# Altium schematic sheet 0253_GPU POWER SEQUENCI.SchDoc
size 848 x 558 mm
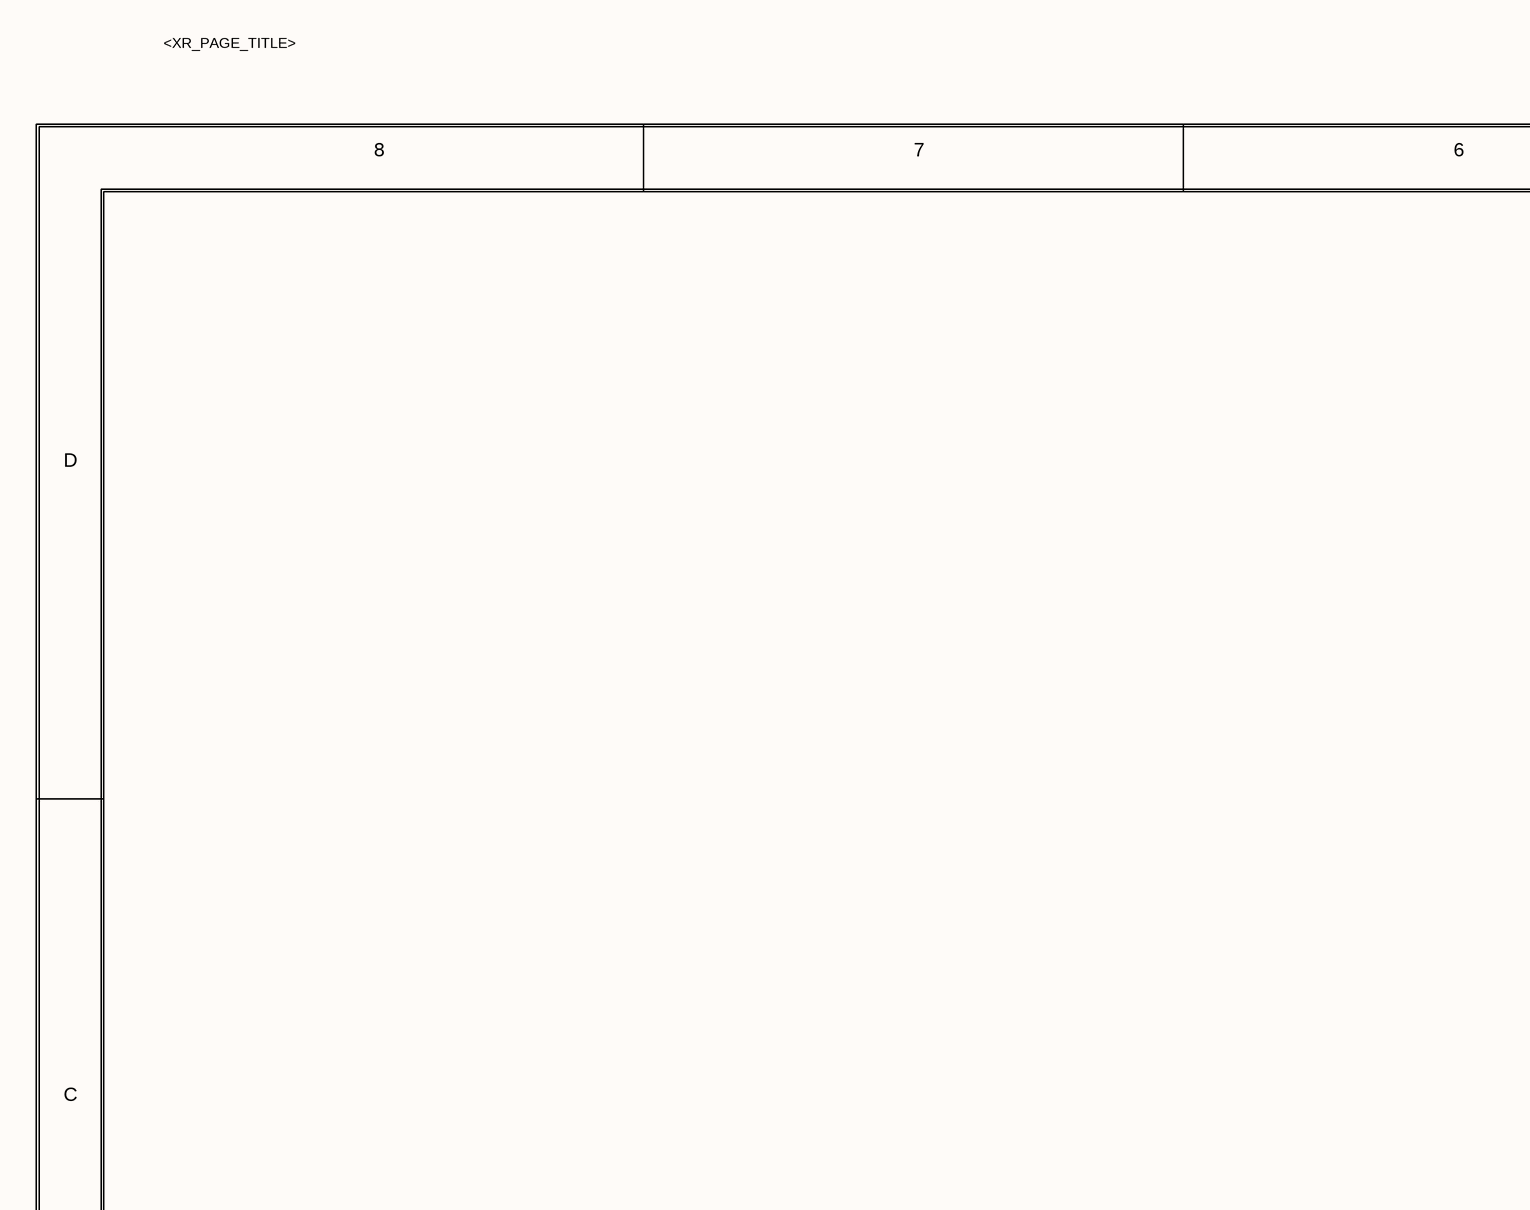
[diagram p0: 0253_GPU POWER SEQUENCI.SchDoc, top left]
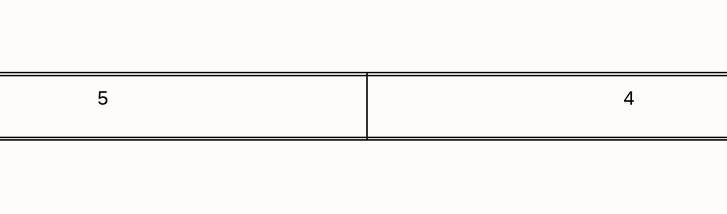
[diagram p1: 0253_GPU POWER SEQUENCI.SchDoc, top middle]
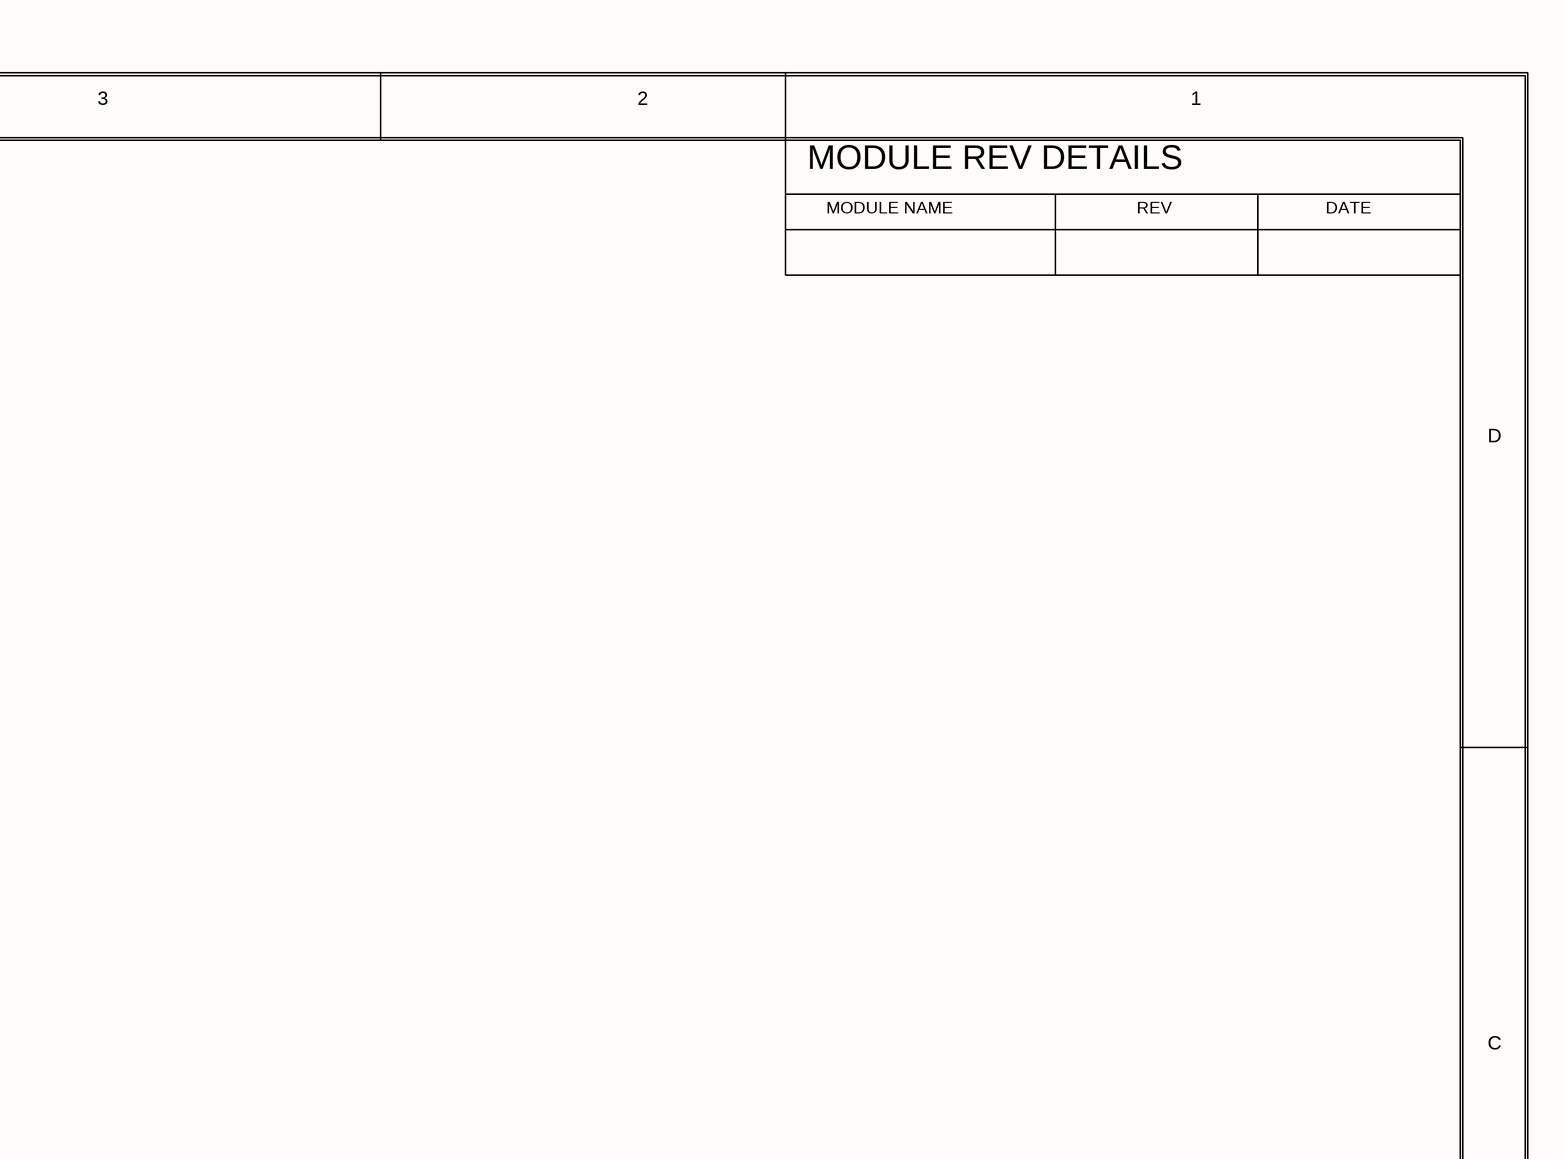
[diagram p2: 0253_GPU POWER SEQUENCI.SchDoc, top right]
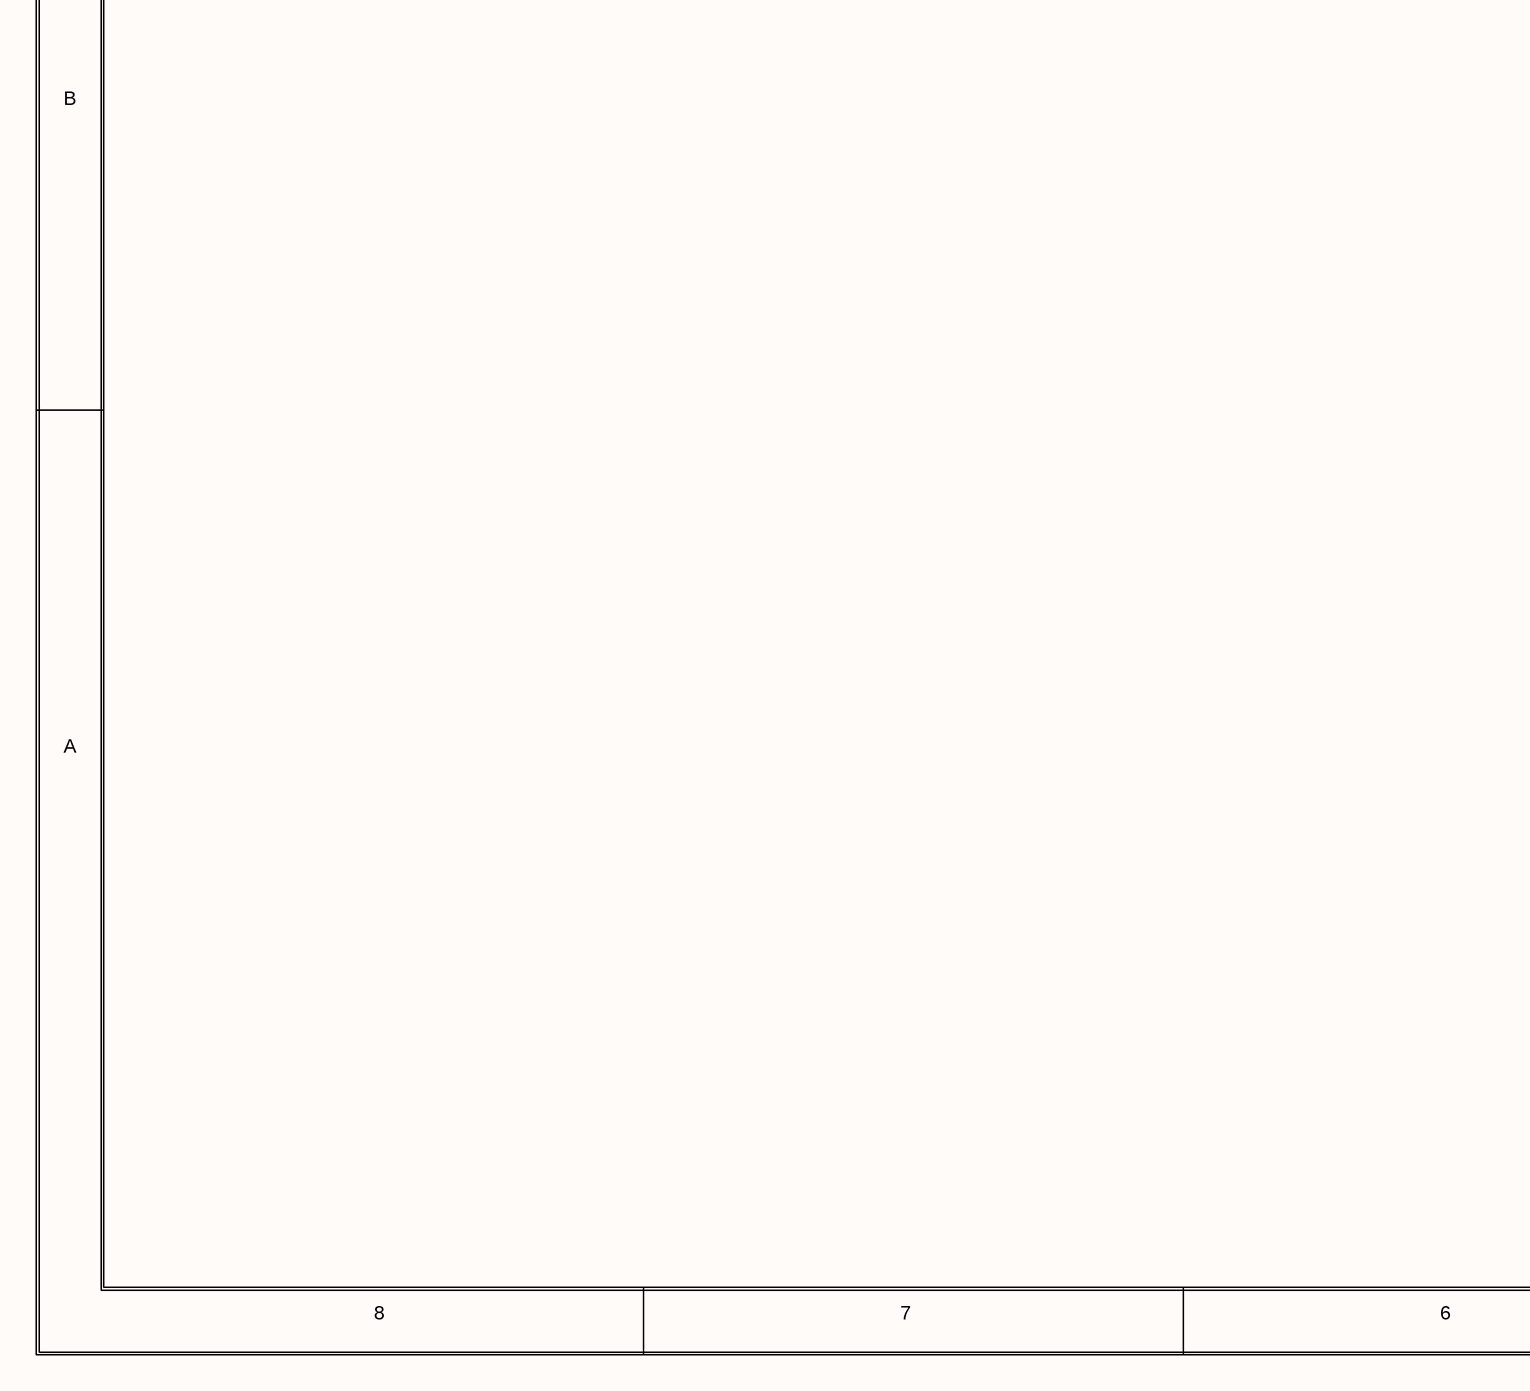
[diagram p3: 0253_GPU POWER SEQUENCI.SchDoc, bottom left]
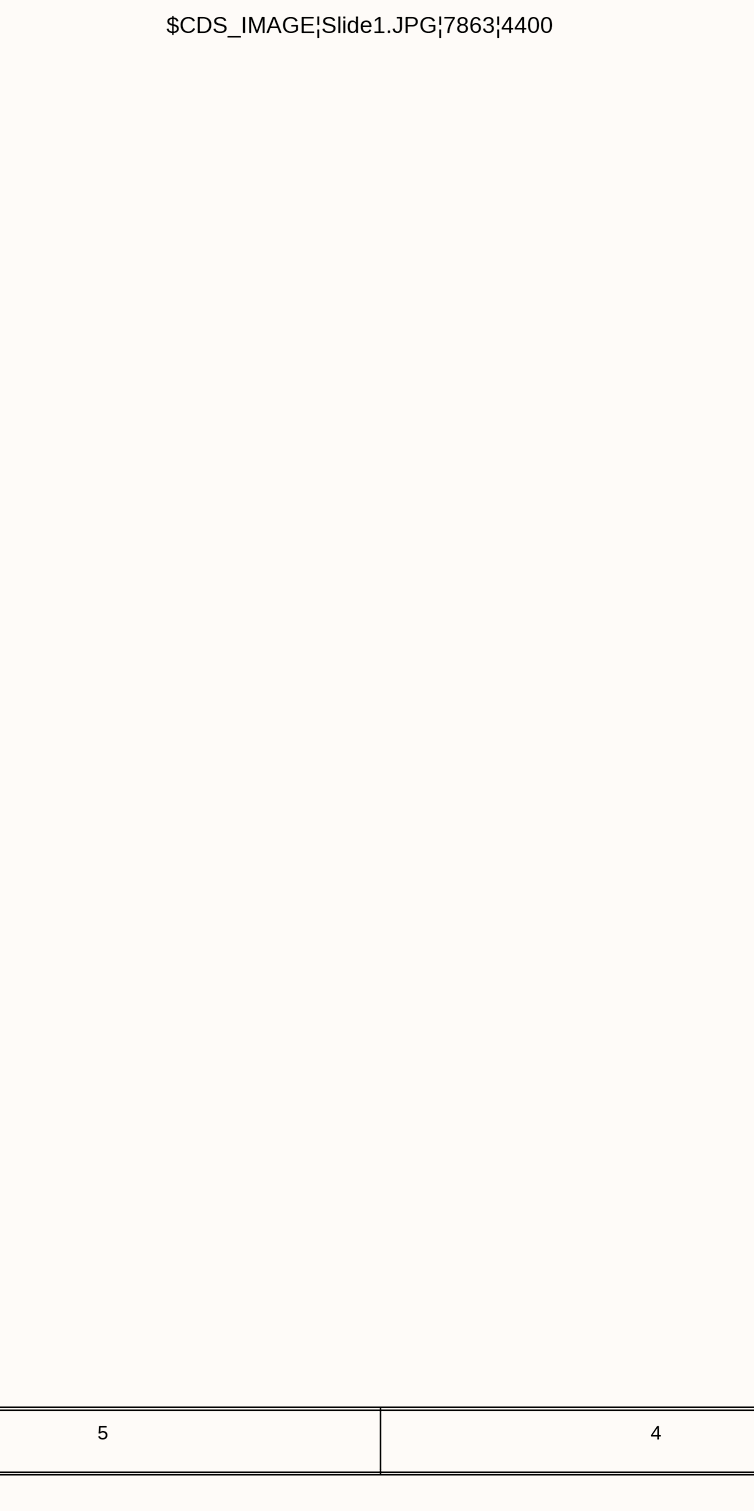
[diagram p4: 0253_GPU POWER SEQUENCI.SchDoc, bottom middle]
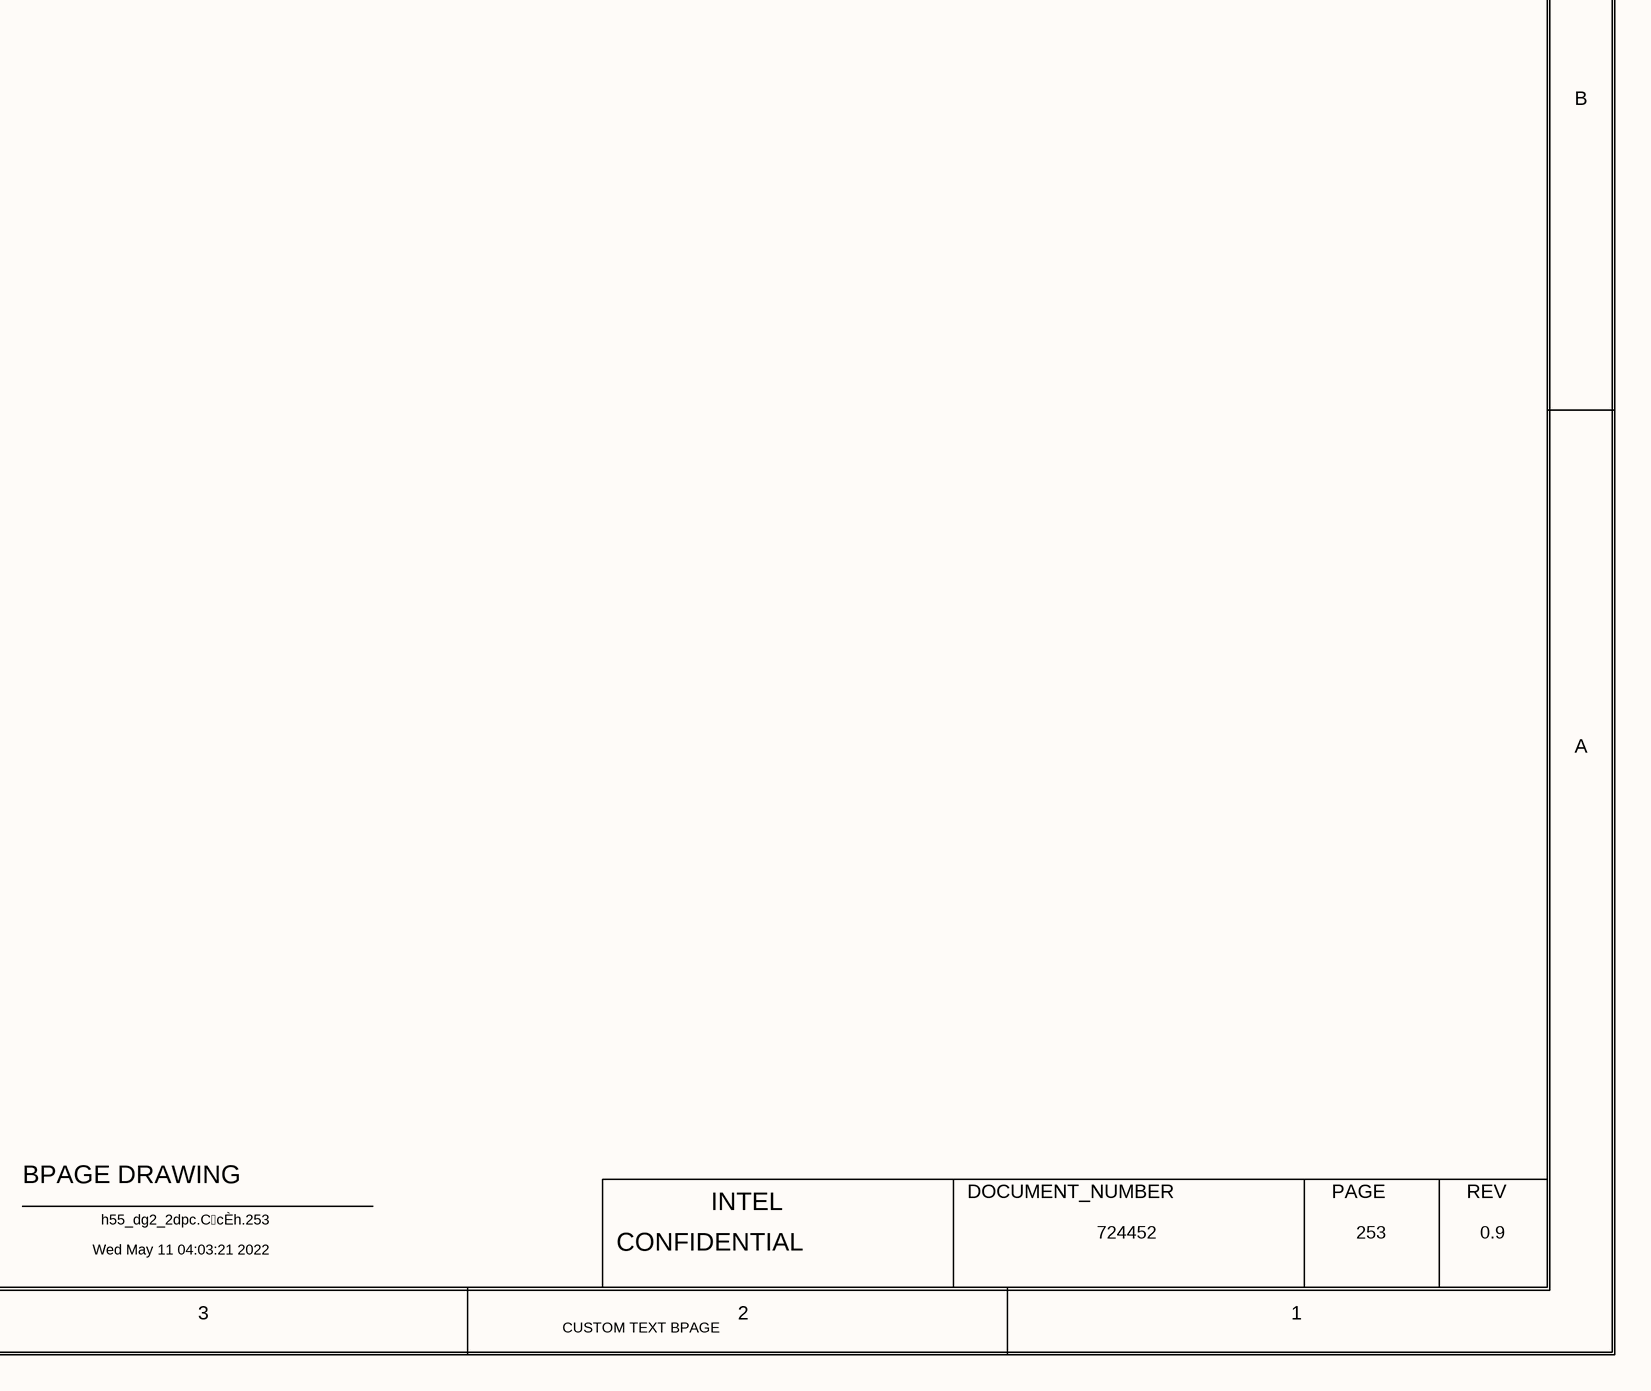
[diagram p5: 0253_GPU POWER SEQUENCI.SchDoc, bottom right]

## Notes on the sheet
- <XR_PAGE_TITLE>
- 8
- 7
- 6
- 5
- 4
- 3
- 2
- 1
- MODULE REV DETAILS
- MODULE NAME
- REV
- DATE
- D
- C
- $CDS_IMAGE|Slide1.JPG|7863|4400
- B
- A
- BPAGE DRAWING
- INTEL
- DOCUMENT_NUMBER
- PAGE
- Wed May 11 04:03:21 2022
- h55_dg2_2dpc.CcÈh.253
- CONFIDENTIAL
- 724452
- 253
- 0.9
- CUSTOM TEXT BPAGE